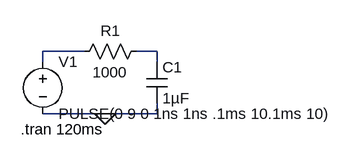
[diagram p0: schematic Draft3.asc]
Draft3.asc, the LTspice schematic file:
Version 4
SHEET 1 880 680
WIRE 96 80 32 80
WIRE 208 80 176 80
WIRE 32 96 32 80
WIRE 208 96 208 80
WIRE 128 176 32 176
WIRE 208 176 208 160
WIRE 208 176 128 176
FLAG 128 176 0
SYMBOL res 192 64 R90
WINDOW 0 0 56 VBottom 2
WINDOW 3 32 56 VTop 2
SYMATTR InstName R1
SYMATTR Value 1000
SYMBOL cap 192 96 R0
SYMATTR InstName C1
SYMATTR Value 1µF
SYMBOL voltage 32 80 R0
WINDOW 123 0 0 Left 2
WINDOW 39 0 0 Left 2
SYMATTR InstName V1
SYMATTR Value PULSE(0 9 0 1ns 1ns .1ms 10.1ms 10)
TEXT -2 200 Left 2 !.tran 120ms

The netlist it stands for:
* Draft3.asc
R1 N002 N001 1000
C1 N002 0 1µF
V1 N001 0 PULSE(0 9 0 1ns 1ns .1ms 10.1ms 10)
.tran 120ms
.backanno
.end